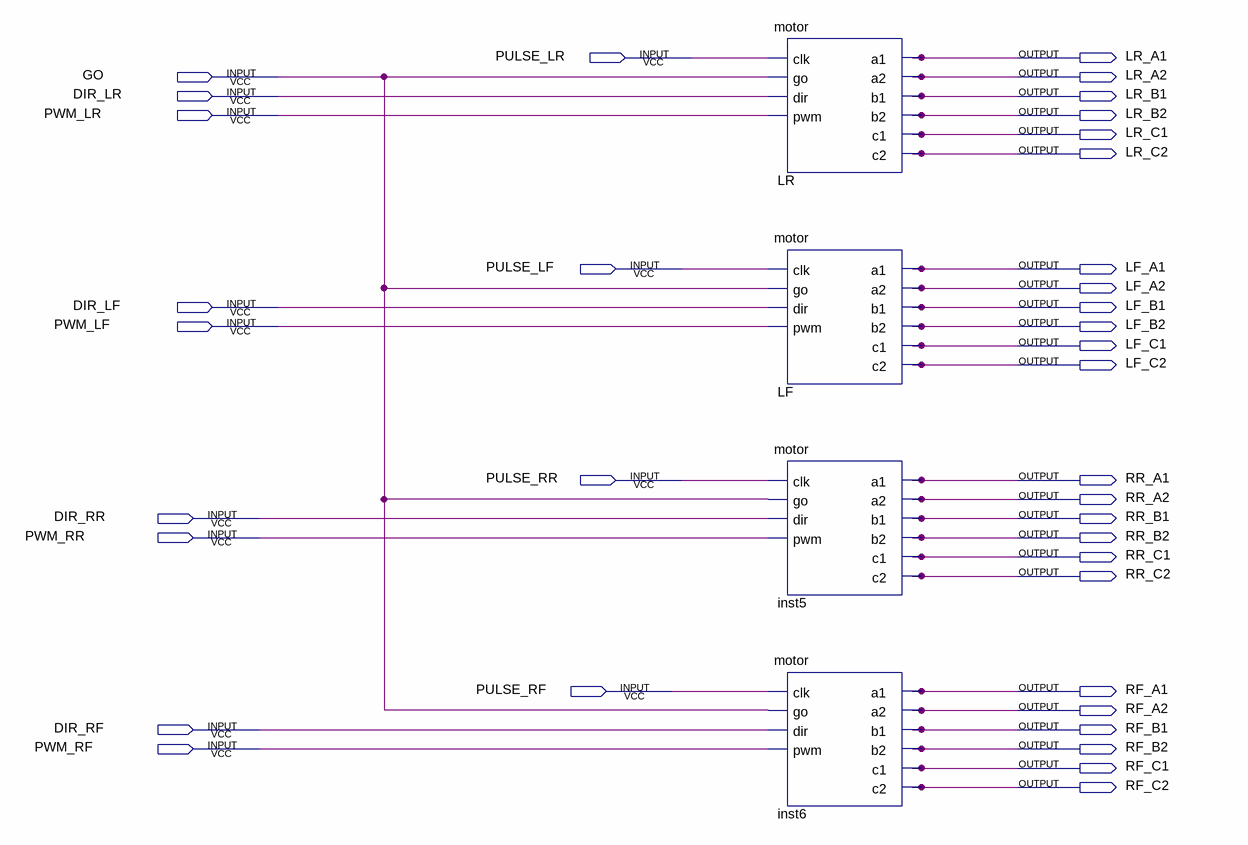
[diagram p0: schematic sheet]
// Quartus schematic quaddrone-main.bdf as structural Verilog: 4 symbols, 37 pins
module \quaddrone-main  (
  input  PULSE_LR,
  input  GO,
  input  DIR_LR,
  input  PWM_LR,
  input  PULSE_LF,
  input  DIR_LF,
  input  PWM_LF,
  input  PULSE_RR,
  input  DIR_RR,
  input  PWM_RR,
  input  PULSE_RF,
  input  DIR_RF,
  input  PWM_RF,
  output LR_A1,
  output LR_A2,
  output LR_B1,
  output LR_B2,
  output LR_C1,
  output LR_C2,
  output LF_A1,
  output LF_A2,
  output LF_B1,
  output LF_B2,
  output LF_C1,
  output LF_C2,
  output RR_A1,
  output RR_A2,
  output RR_B1,
  output RR_B2,
  output RR_C1,
  output RR_C2,
  output RF_A1,
  output RF_A2,
  output RF_B1,
  output RF_B2,
  output RF_C1,
  output RF_C2
);

  motor LR (
    .clk(PULSE_LR), .go(GO), .dir(DIR_LR), .pwm(PWM_LR), .a1(LR_A1), .a2(LR_A2), .b1(LR_B1), .b2(LR_B2),
    .c1(LR_C1), .c2(LR_C2));
  motor LF (
    .clk(PULSE_LF), .go(GO), .dir(DIR_LF), .pwm(PWM_LF), .a1(LF_A1), .a2(LF_A2), .b1(LF_B1), .b2(LF_B2),
    .c1(LF_C1), .c2(LF_C2));
  motor inst5 (
    .clk(PULSE_RR), .go(GO), .dir(DIR_RR), .pwm(PWM_RR), .a1(RR_A1), .a2(RR_A2), .b1(RR_B1), .b2(RR_B2),
    .c1(RR_C1), .c2(RR_C2));
  motor inst6 (
    .clk(PULSE_RF), .go(GO), .dir(DIR_RF), .pwm(PWM_RF), .a1(RF_A1), .a2(RF_A2), .b1(RF_B1), .b2(RF_B2),
    .c1(RF_C1), .c2(RF_C2));
endmodule
